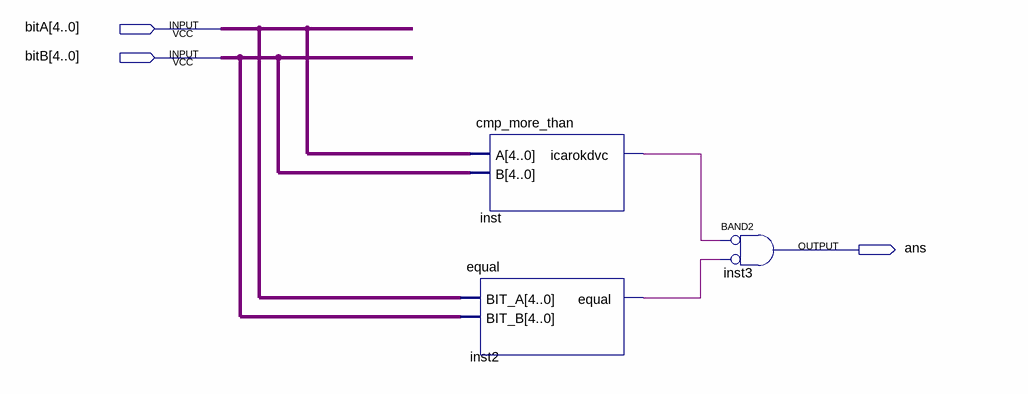
[diagram p0: schematic sheet]
// Quartus schematic comparison_LT.bdf as structural Verilog: 3 symbols, 3 pins
module comparison_LT (
  input  [4:0] bitA,
  input  [4:0] bitB,
  output ans
);

  wire inst2_equal, inst_icarokdvc;

  cmp_more_than inst (.A(bitA), .B(bitB), .icarokdvc(inst_icarokdvc));
  equal inst2 (.BIT_A(bitA), .BIT_B(bitB), .equal(inst2_equal));
  and inst3 (ans, ~inst_icarokdvc, ~inst2_equal);  // BAND2
endmodule
